# Altium project TSAL_Control.PrjPcb (part 4 of 4)
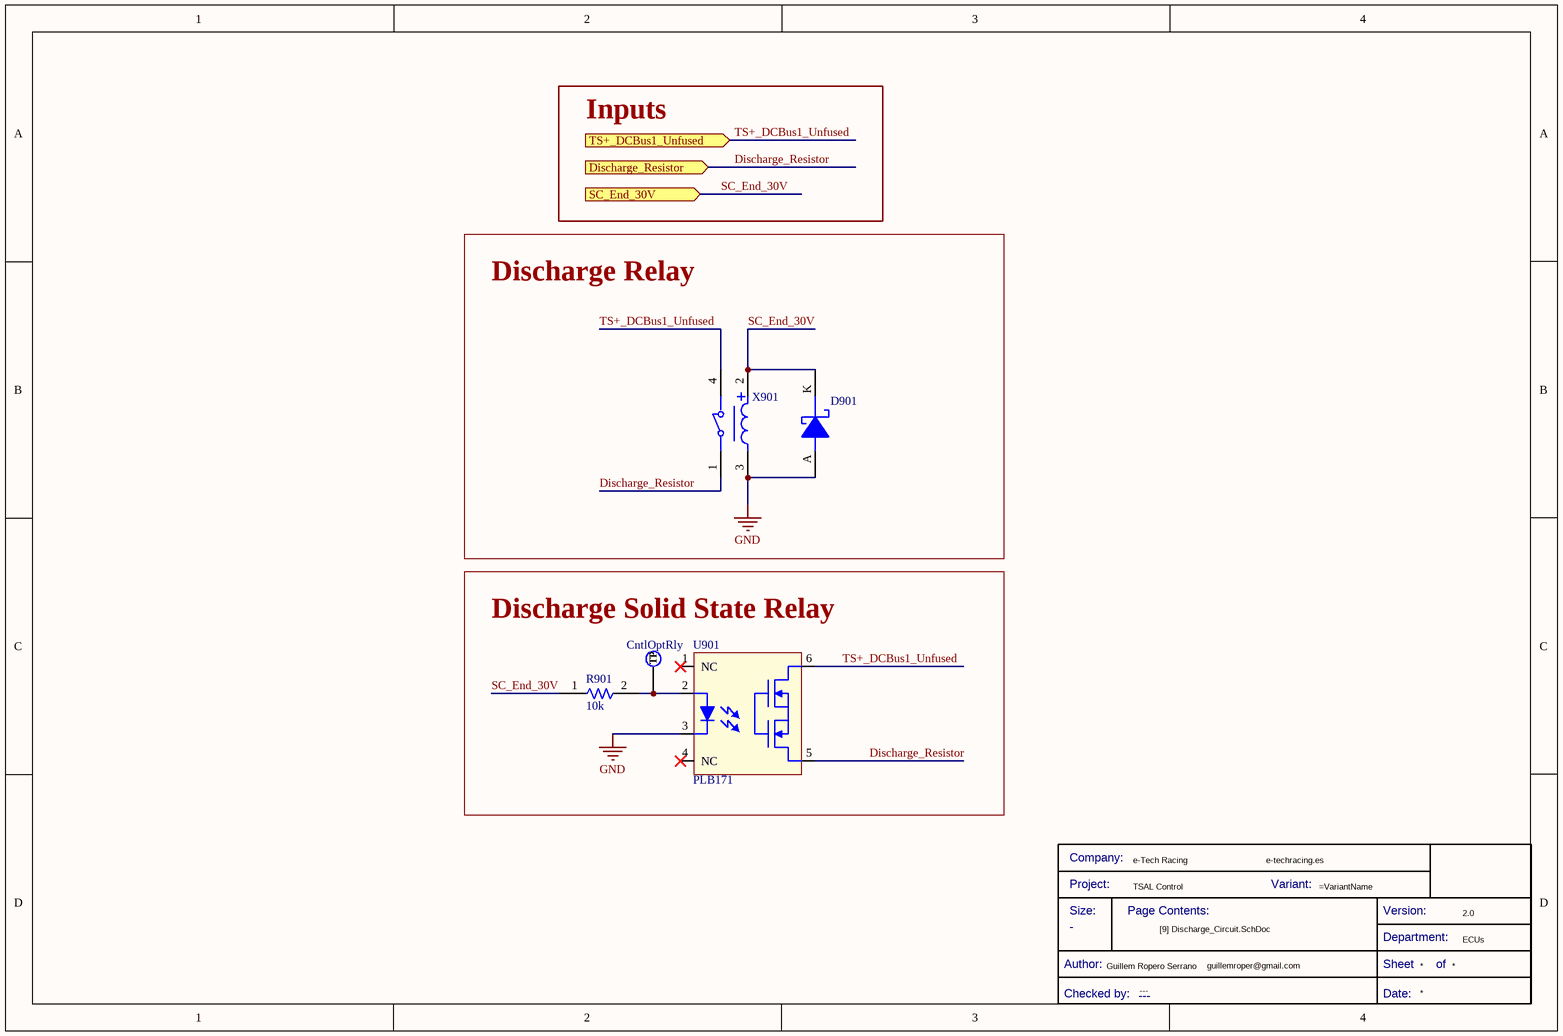
[diagram p10: [9] Discharge_Circuit.SchDoc]

## Nets that join several sheets
+12: TSAL_Control (6 pins), [1] TSAL_Green (C101.1 C111.2 U101.14), [2] Implausibilities (6 pins), [3] Relay Implausibility (5 pins), [5] SCS (16 pins), [4] NoHV_RelaysClosed (C401.1 U401.14), [7] TSAL_Red (6 pins)
GND: TSAL_Control (18 pins), [1] TSAL_Green (C101.2 U101.7), [2] Implausibilities (10 pins), [3] Relay Implausibility (6 pins), [5] SCS (19 pins), [4] NoHV_RelaysClosed (C401.2 C444.2 U401.7), [6] Green_Driver (Q601.S R602.2), [7] TSAL_Red (7 pins), [8] Red_Driver (Q801.S R802.2), [9] Discharge_Circuit (D901.A U901.3 X901.3)
AIR+_Coil: TSAL_Control (R3.2 Z1.K), [1] TSAL_Green (A+Coil.1), [3] Relay Implausibility (U301.1), [4] NoHV_RelaysClosed (U401.8)
AIR+_State: TSAL_Control (J1.1), [1] TSAL_Green (A+St.1 U101.1), [3] Relay Implausibility (U301.2), [5] SCS (R519.1 U502.11)
AIR-_Coil: TSAL_Control (R5.2 Z2.K), [1] TSAL_Green (A-Coil.1), [3] Relay Implausibility (U301.5), [4] NoHV_RelaysClosed (U401.1)
AIR-_State: TSAL_Control (J1.2), [1] TSAL_Green (A-St.1 U101.2), [3] Relay Implausibility (U301.6), [5] SCS (R516.1 U502.9)
Discharge_Resistor: TSAL_Control (J2.1 J2.2), [9] Discharge_Circuit (U901.5 X901.1)
HV_Accumulator: TSAL_Control (J1.4), [1] TSAL_Green (HVAcc.1 U101.8), [5] SCS (R518.1 U502.5), [4] NoHV_RelaysClosed (U302.3)
HV_Detection_Trigger: [5] SCS (R510.2), [7] TSAL_Red (HVDetTrg.1 J701.2 U702.4)
INV_HV_Detection: TSAL_Control (Q1.D R1.2), [7] TSAL_Red (J701.3)
No_Voltage_Relays_Closed: [2] Implausibilities (U201.3), [4] NoHV_RelaysClosed (C444.1 NHVRlyCls.1 U302.6)
Precharge_Coil: TSAL_Control (R7.2 Z3.K), [1] TSAL_Green (PreCoil.1), [3] Relay Implausibility (U301.9), [4] NoHV_RelaysClosed (U401.2)
Precharge_State: TSAL_Control (J1.3), [1] TSAL_Green (PreSt.1 U101.3), [3] Relay Implausibility (U301.8), [5] SCS (R517.1 U502.7)
Relays_Implausibility: [2] Implausibilities (U201.2), [3] Relay Implausibility (C333.1 RlyImp.1 U302.9)
Safe_State: [1] TSAL_Green (C111.1 U101.4), [2] Implausibilities (SfSt.1 U202.9 U202.11)
SC_End: TSAL_Control (R9.2 Z4.K), [1] TSAL_Green (SCEnd.1), [3] Relay Implausibility (U302.2), [4] NoHV_RelaysClosed (U302.4)
SC_End_30V: TSAL_Control (J1.13 J6.2 R9.1), [9] Discharge_Circuit (D901.K R901.1 X901.2)
SCS_Error: [2] Implausibilities (U201.4), [5] SCS (C555.1 SCSErr.1 U501.1)
TS+_DCBus1: TSAL_Control (F3.1), [7] TSAL_Red (R705.1)
TS+_DCBus1_Unfused: TSAL_Control (F3.2 J3.1 J3.2), [9] Discharge_Circuit (U901.6 X901.4)
TS-: TSAL_Control (J4.1 J4.2 J5.1 J5.2), [7] TSAL_Red (9 pins)
TS_Off: TSAL_Control (J1.5), [1] TSAL_Green (TSOff.1 U101.6), [5] SCS (R509.1), [6] Green_Driver (R601.1)
TS_On: TSAL_Control (J1.15), [7] TSAL_Red (TSOn.1 U702.3), [8] Red_Driver (R801.1)
TSAL_Green: TSAL_Control (J1.9), [5] SCS (U503.7), [6] Green_Driver (R603.1 TSALGrn.1)
TSAL_Red: TSAL_Control (J1.14), [5] SCS (U503.9), [8] Red_Driver (R803.1 TSALRed.1)